# EAGLE schematic Будильник (EAGLE 9.1.3)
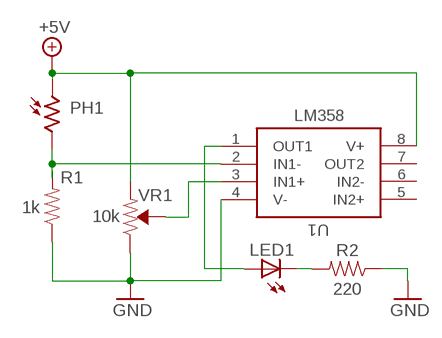
[diagram p0: schematic, sheet 1]

## Parts
LED1  LED  [SMARTLED-TTW]
PH1  D1160_12  [D11XX]
R1  1k  10MOHM-HORIZ-1/4W-5%  [AXIAL-0.3]
R2  220  10MOHM-HORIZ-1/4W-5%  [AXIAL-0.3]
U1  LM358  LM358DR  [LM358DR]
VR1  10k  TRIMPOT-PTH-10MM-KNOB-1/2W-10%  [TRIMPOT-PTH-3386U]

## Nets
+5V: PH1.1 U1.8(V+) VR1.1(CCW)
GND: R1.P$1 R2.P$1 U1.4(V-) VR1.3(CW)
N$1: PH1.2 R1.P$2 U1.2(IN1-)
N$2: U1.3(IN1+) VR1.2(WIPER)
N$3: LED1.C@1(C) R2.P$2
N$4: LED1.A@1(A) U1.1(OUT1)
Unconnected: U1.5(IN2+) U1.6(IN2-) U1.7(OUT2)

## Library data of the parts
LED1 = adafruit:LED: LED OSRAM: - CHIPLED LG R971, LG N971, LY N971, LG Q971, LY Q971, LO R971, LY R971 LH N974, LH R974 LS Q976, LO Q976, LY Q976 LO Q996 - Hyper CHIPLED LW Q18S LB Q993, LB Q99A, LB R99A - SideLED LS A670, LO A670, LY A670, LG A670, LP A670 LB A673, LV A673, LT A673, LW A673 LH A674 LY A675 LS A676, LA A676, LO A676, LY A676, LW A676 LS A679, LY A679, LG A679 - Hyper Micro SIDELED® LS Y876, LA Y876, LO Y876, LY Y876 LT Y87S - SmartLED LW L88C, LW L88S LB L89C, LB L89S, LG L890 LS L89K, LO L89K, LY L89K LS L896, LA L896, LO L896, LY L896 - TOPLED LS T670, LO T670, LY T670, LG T670, LP T670 LSG T670, LSP T670, LSY T670, LOP T670, LYG T670 LG T671, LOG T671, LSG T671 LB T673, LV T673, LT T673, LW T673 LH T674 LS T676, LA T676, LO T676, LY T676, LB T676, LH T676, LSB T676, LW T676 LB T67C, LV T67C, LT T67C, LS T67K, LO T67K, LY T67K, LW E67C LS E67B, LA E67B, LO E67B, LY E67B, LB E67C, LV E67C, LT E67C LW T67C LS T679, LY T679, LG T679 LS T770, LO T770, LY T770, LG T770, LP T770 LB T773, LV T773, LT T773, LW T773 LH T774 LS E675, LA E675, LY E675, LS T675 LS T776, LA T776, LO T776, LY T776, LB T776 LHGB T686 LT T68C, LB T68C - Hyper Mini TOPLED® LB M676 - Mini TOPLED Santana® LG M470 LS M47K, LO M47K, LY M47K Source: http://www.osram.convergy.de/
PH1 = photo-elements:D11: Photo Sensor Oil Burner Control Applications Source: http://optoelectronics.perkinelmer.com/content/Datasheets/DTS_PhotocellsD1160.pdf
R1 R2 = SparkFun-Resistors:10MOHM: RES-09327; PROD_ID: RES-09327; VALUE: 10M
U1 = IC:LM358DR: IC OPAMP GP 2 CIRCUIT 8SOIC Manufacturer's datasheet <http://www.ti.com/lit/ds/symlink/lm358.pdf>; CREATED_BY: PCBLayout.com; DIGIKEY_PART_NUMBER: 296-1014-1-ND; MANUFACTURER: Texas Instruments; MPN: LM358; PACKAGE: 8-SOIC
VR1 = SparkFun-Resistors:TRIMPOT: Trimming Potentiometer (Trimpot) Three-terminal potentiometers, with an adjustable wiper and two adjustable resistors. A pot can be used to create a configurable voltage divider, or as a variable resistor. "Trimpots" are a subset of potentiometers, usually intended for "set-and-forget" applications. They're often more delicate than standard potentiometers - rated for fewer turns. Variants PTH-KNOB - PTH Trimpot w/ finger-adjustable knob Trimpot 10K with Knob <https://www.sparkfun.com/products/9806> (COM-09806) Datasheet <http://www.sparkfun.com/datasheets/Components/General/TSR-3386.pdf> SMD-3MM-CLOSED-FRAME - SMD 3mm Square Closed-Frame Trimpot Used on e.g. EasyDriver - Stepper Motor Driver <https://www.sparkfun.com/products/12779> Datasheet <http://www.bitechnologies.com/pdfs/22.pdf> (22AR10KTR) SMD-5MM - SMD 5mm Square Closed-Frame Trimpot Used on e.g. IOIO-OTG - V2.2 <https://www.sparkfun.com/products/13613> Datasheet <http://www.vishay.com/docs/51008/ts53.pdf> (TS53YL502MR10) SMD-3MM-1/10W-25% - 3mm Square Open-Frame Trimpot Used on e.g. SparkFun Shapeoko <https://www.sparkfun.com/products/13899> Datasheet <http://www.bourns.com/docs/Product-Datasheets/TC33.pdf> (TC33X-2-103E); PROD_ID: RES-09730; SF_SKU: COM-09806